# Altium schematic sheet Sheet4.SCHDOC
size 840 x 594 mm; SheetNumber: 4; SheetTotal: 5; DocumentName: Sheet4.SCHDOC
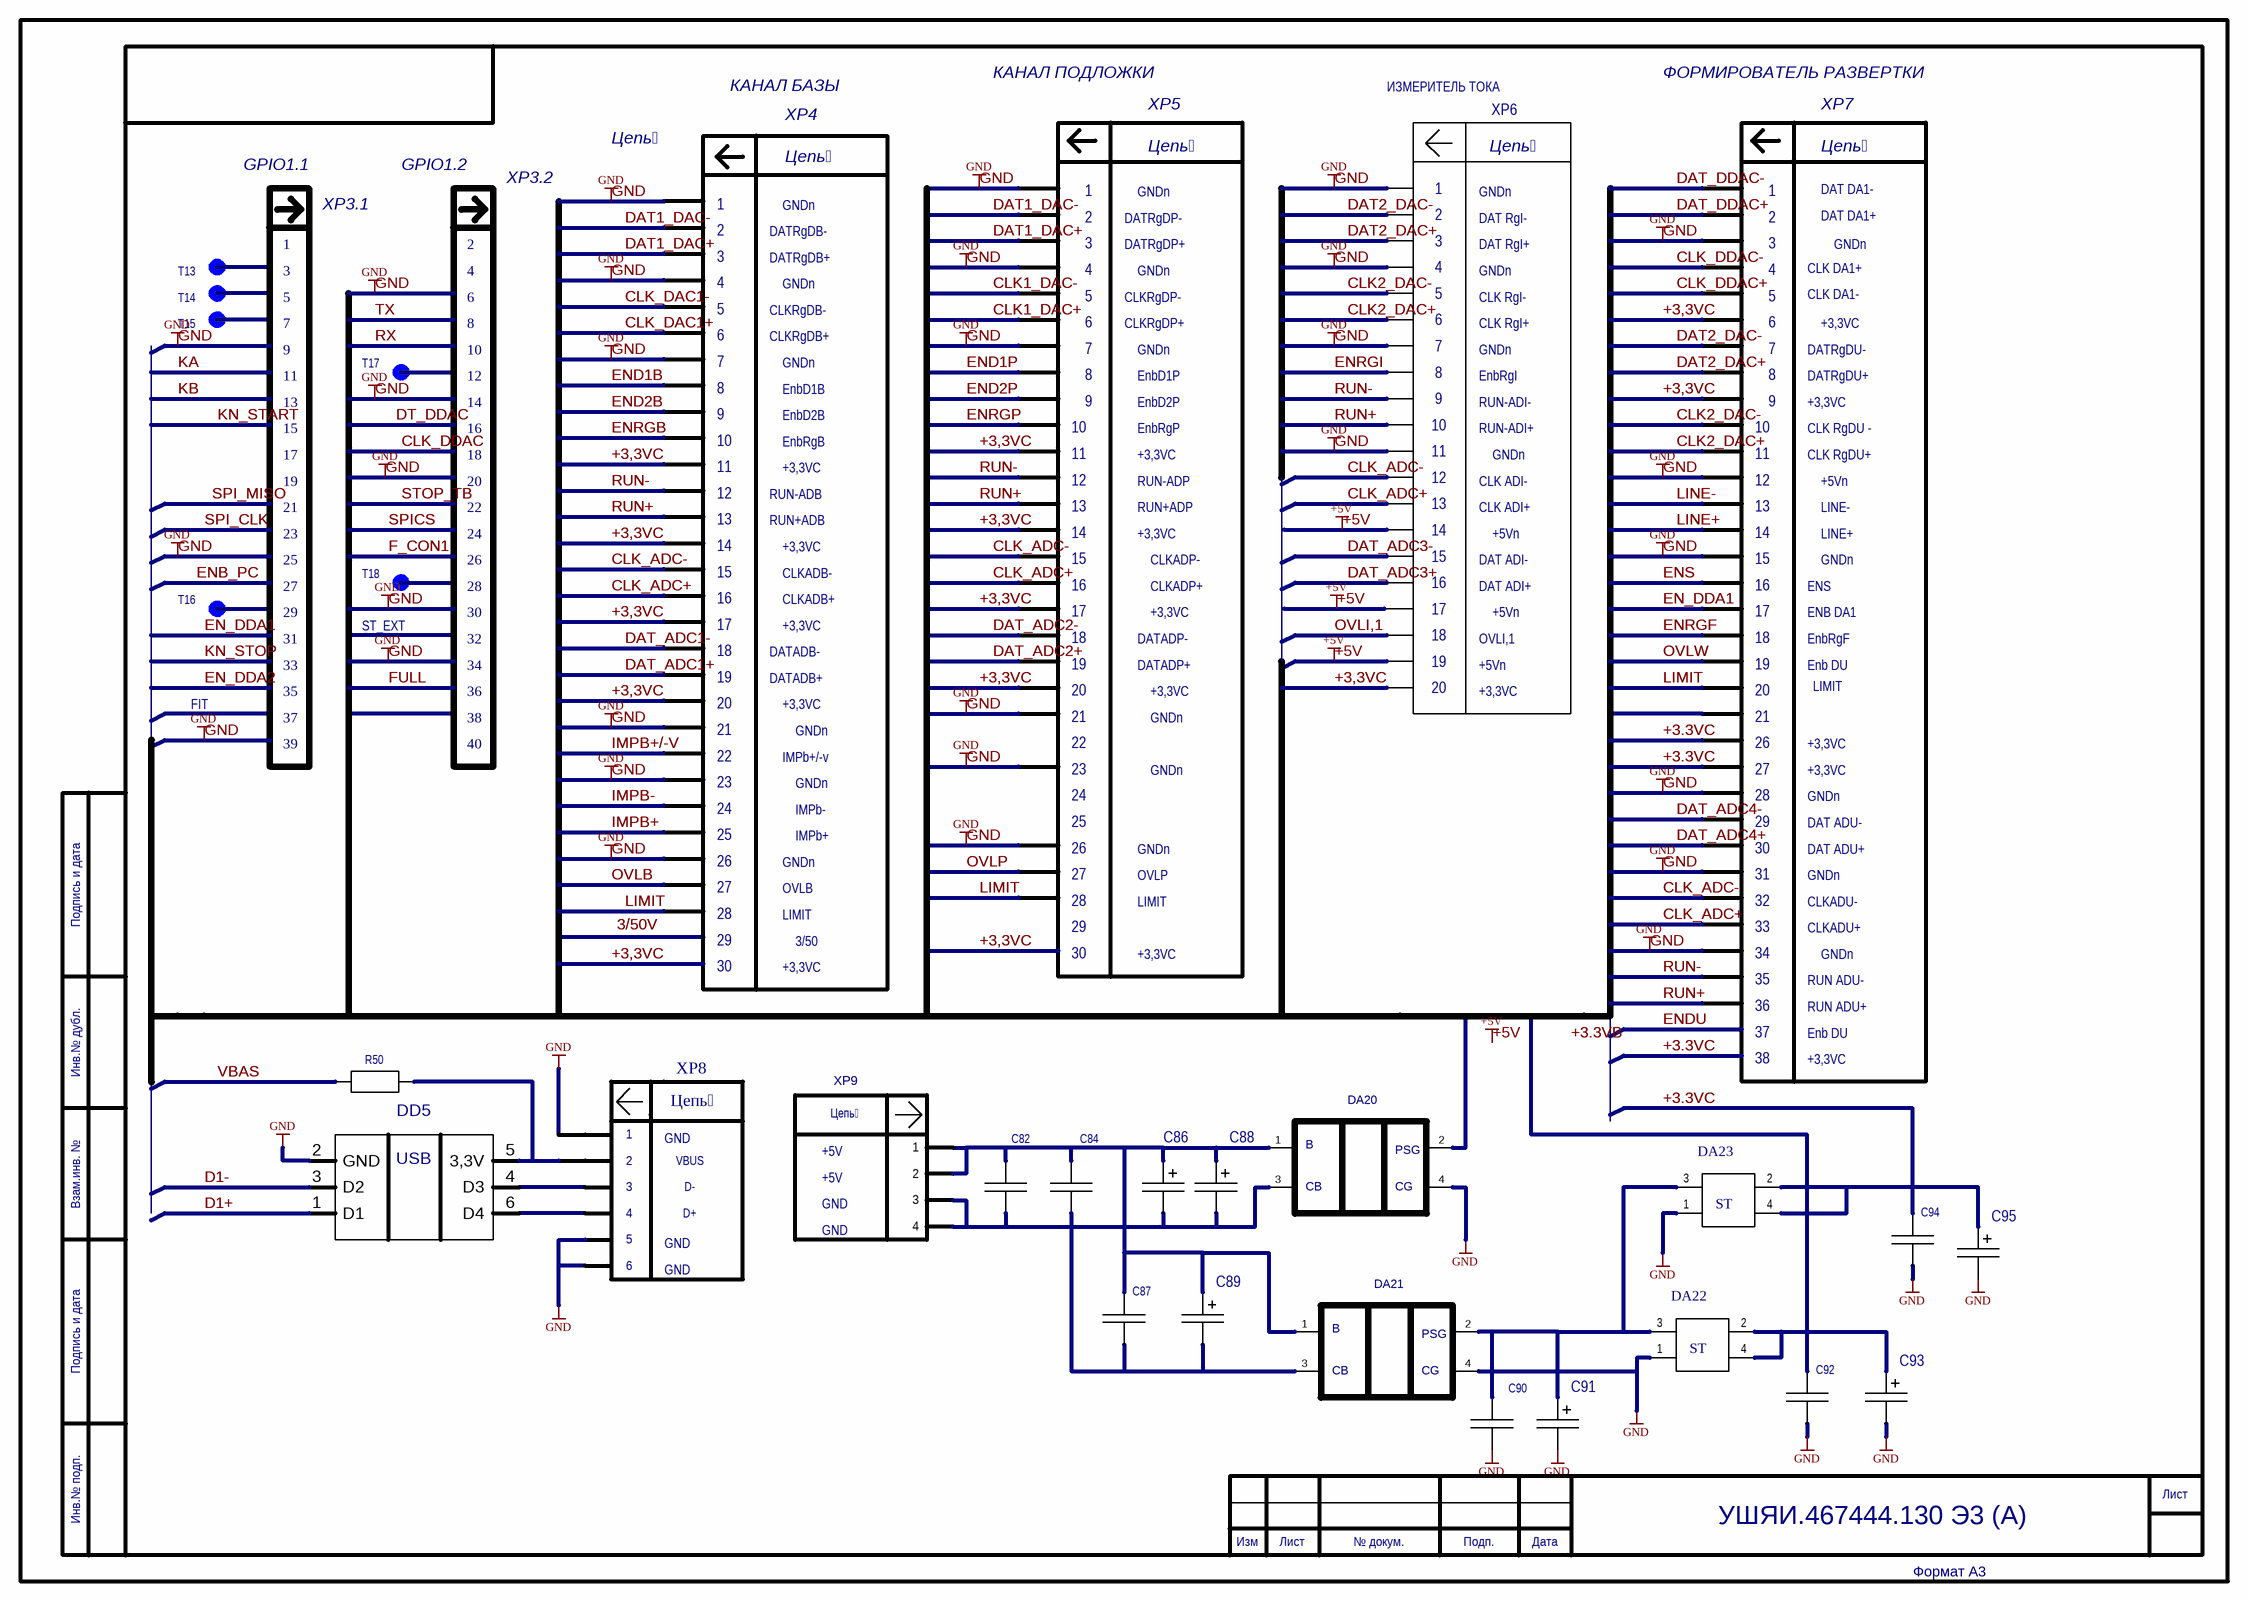
[diagram p0: Sheet4.SCHDOC]

## Parts
C82  GRM21BR71H104KA01L  (value not drawn)
C84  GRM21BR71H104KA01L  (value not drawn)
C86  TAJB106M016  (value not drawn)
C87  GRM21BR71H104KA01L  (value not drawn)
C88  TAJB106M016  (value not drawn)
C89  TAJB106M016  (value not drawn)
C90  GRM21BR71H104KA01L  (value not drawn)
C91  TAJB106M016  (value not drawn)
C92  GRM21BR71H104KA01L  (value not drawn)
C93  TAJB106M016  (value not drawn)
C94  GRM21BR71H104KA01L  (value not drawn)
C95  TAJB106M016  (value not drawn)
DA20  BNX028  (value not drawn)
DA21  BNX028  (value not drawn)
DA22  LD1117AS33TR  (value not drawn)
DA23  LD1117AS33TR  (value not drawn)
DD5  USBUF01W6  (value not drawn)
R50  0603-30 ОМ+-5%  [0603]  (value not drawn)
T40  ТОЧКА ПАЙКИ 1  [LEPESTOK7_750_224]  (value not drawn)
T41  ТОЧКА ПАЙКИ 1  [LEPESTOK7_750_224]  (value not drawn)
T46  ТОЧКА ПАЙКИ 1  [LEPESTOK7_750_224]  (value not drawn)
T47  ТОЧКА ПАЙКИ 1  [LEPESTOK7_750_224]  (value not drawn)
T59  ТОЧКА ПАЙКИ 1  [LEPESTOK7_750_224]  (value not drawn)
T65  ТОЧКА ПАЙКИ 1  [LEPESTOK7_750_224]  (value not drawn)
XP6  BH-20-A  (value not drawn)
XP8  AMP II 280372-2  (value not drawn)
XP9  AMP 0-0280371-1  (value not drawn)

## Nets
+5V: XP6.14 XP6.19
GND: C90.2 C91.2 C92.2 C93.2 C94.2 C95.2 DA20.4 DA21.4 DA22.1 DA23.1 DD5.2(GND) XP6.1 XP6.4 XP6.7 XP6.11 XP8.5 XP8.6
+3,3VC: XP6.20
+3.3VC: C94.1 C95.1 DA23.2 DA23.4
CLK2_DAC+: XP6.6
CLK2_DAC-: XP6.5
CLK_ADC+: XP6.13
CLK_ADC-: XP6.12
D1+: DD5.1(D1)
D1-: DD5.3(D2)
DAT2_DAC+: XP6.3
DAT2_DAC-: XP6.2
DAT_ADC3+: XP6.16
DAT_ADC3-: XP6.15
ENRGI: XP6.8
OVLI,1: XP6.18
RUN+: XP6.10
RUN-: XP6.9
VBAS: R50.1
NetC82_1: C82.1 C84.1 C86.1 C87.1 C88.1 C89.1 DA20.1 DA21.1 XP9.1 XP9.2
NetC82_2: C82.2 C84.2 C86.2 C87.2 C88.2 C89.2 DA20.3 DA21.3 XP9.3 XP9.4
NetC90_1: C90.1 C91.1 DA21.2 DA22.3 DA23.3
NetC92_1: C92.1 C93.1 DA22.2 DA22.4
NetDD5_4: DD5.4(D3) XP8.3
NetDD5_5: DD5.5(3,3V) R50.2
NetDD5_6: DD5.6(D4) XP8.4

Not connected (* = marked no-connect by the designer): DA20 2; T40 1; T41 1; T46 1; T47 1; T59 1; T65 1; XP6 17; XP8 1 2

## Notes on the sheet
- КАНАЛ БАЗЫ
- КАНАЛ ПОДЛОЖКИ
- XP5
- ИЗМЕРИТЕЛЬ ТОКА
- ФОРМИРОВАТЕЛЬ РАЗВЕРТКИ
- XP7
- GPIO1.1
- GPIO1.2
- XP3.2
- Цепь
- XP4
- 1
- XP3.1
- 2
- DATRgDB-
- GNDn
- 3
- DATRgDP-
- DATRgDP+
- DAT RgI-
- DAT RgI+
- DAT DA1+
- DAT DA1-
- T14
- T13
- 5
- 6
- 4
- DATRgDB+
- CLKRgDB-
- CLKRgDP-
- CLK RgI-
- CLK DA1-
- CLK DA1+
- T15
- 11
- 9
- 7
- (near T59) T17
- 8
- (near T59) 12
- 10
- CLKRgDB+
- CLKRgDP+
- EnbD1P
- EnbRgI
- CLK RgI+
- DATRgDU+
- DATRgDU-
- +3,3VC
- 15
- 13
- 16
- 14
- EnbD2B
- EnbRgB
- EnbD1B
- EnbD2P
- EnbRgP
- RUN-ADI-
- RUN-ADI+
- CLK RgDU -
- 17
- 21
- 19
- 18
- 22
- 20
- 12
- RUN-ADB
- RUN-ADP
- RUN+ADP
- CLK ADI-
- CLK ADI+
- CLK RgDU+
- +5Vn
- LINE-
- 23
- 25
- (near T47) T18
- 24
- 26
- RUN+ADB
- CLKADB-
- CLKADP-
- DAT ADI-
- LINE+
- (near T65) T16
- (near T65) 29
- 31
- 27
- (near T47) ST_EXT
- 30
- 32
- (near T47) 28
- CLKADB+
- DATADP-
- CLKADP+
- OVLI,1
- DAT ADI+
- ENB DA1
- ENS
- EnbRgF
- FIT
- 33
- 35
- 34
- 36
- DATADB-
- DATADB+
- DATADP+
- Enb DU
- LIMIT
- 39
- 37
- 40
- 38
- IMPb+/-v
- IMPb-
- IMPb+
- 29
- 28
- DAT ADU-
- Подпись и дата
- OVLB
- OVLP
- CLKADU-
- DAT ADU+
- 3/50
- RUN ADU-
- CLKADU+
- Инв.№ дубл.
- RUN ADU+
- Взам.инв. №
- (near XP8) GND
- VBUS
- D-
- +5V
- D+
- GND
- Инв.№ подп.
- УШЯИ.467444.130 Э3 (A)
- Лист
- Изм
- № докум.
- Подп.
- Дата
- Формат А3
- Подп. дата
- Инв. № дубл.
- Взам. инв. №
- Подп. и дата
- Инв. № подл.
- Изм.
- ALTIUM GOSTBOM2.0 KEV
- Файл:
- Копировал
- (in symbol AMP 0-0280371-1) Цепь
- (in symbol AMP II 280372-2) Цепь
- (in symbol BNX028) B; PSG; CB; CG
- (in symbol LD1117AS33TR) ST
- (in symbol USBUF01W6) USB

## Library data of the parts
C82 C84 C87 C90 C92 C94 = GRM21BR71H104KA01L: Name2: Конденсатор GRM21BR71H104KA01L; Value: *; Name1: Конденсатор GRM21BR71H104KA01L
C86 C88 C89 C91 C93 C95 = TAJB106M016: Standart: AVX; Name2: Конденсатор  TAJB106M016; Name1: Конденсатор TAJB106M016; Value: *
DD5 = USBUF01W6: Name1: Микросхема USBUF01W6; Standart: STMicroelectronics; Value: *; Name2: Микросхема USBUF01W6
R50 = 0603-30 ОМ+-5%: Name1: Резистор 0603-30 Ом+-5%; Name2: Резистор 0603-30 Ом+-5%
T40 T41 T46 T47 T59 T65 = ТОЧКА ПАЙКИ 1: Name: Точка пайки; Value: *
XP6 = BH-20-A: Standart: Белконтмаш; Name2: Вилка BH-20; Name1: Вилка BH-20 Белконтмаш; Value: *
XP8 = AMP II 280372-2: Standart: ELFA (43-834-28); Name2: Вилка AMP II-280372-2 Tyco Electronics; Value: *; Name1: Вилка AMP II-280372-2 Tyco Electronics
XP9 = AMP 0-0280371-1: Name2: Вилка AMP 0-280371-2; Name1: Вилка AMP 0-280371-2 Tyco Electronics; Value: *
DA20 DA21 = BNX028: Value: *
DA22 DA23 = LD1117AS33TR: Value: *